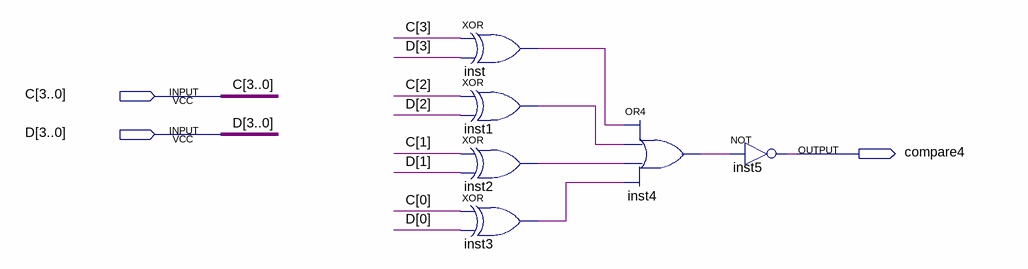
[diagram p0: schematic sheet]
// Quartus schematic compare4.bdf as structural Verilog: 6 symbols, 3 pins
module compare4 (
  input  [3:0] C,
  input  [3:0] D,
  output compare4
);

  wire inst1_out, inst2_out, inst3_out, inst4_out, inst_out;

  xor inst (inst_out, C[3], D[3]);
  xor inst1 (inst1_out, C[2], D[2]);
  xor inst2 (inst2_out, C[1], D[1]);
  xor inst3 (inst3_out, C[0], D[0]);
  or inst4 (inst4_out, inst_out, inst1_out, inst2_out, inst3_out);
  not inst5 (compare4, inst4_out);
endmodule
